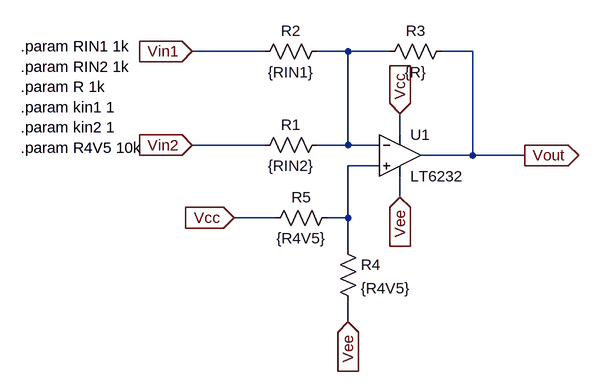
[diagram p0: schematic Addierer.asc]
Addierer.asc, the LTspice schematic file:
Version 4
SHEET 1 1296 680
WIRE -224 -128 -336 -128
WIRE -96 -128 -144 -128
WIRE -32 -128 -96 -128
WIRE 96 -128 48 -128
WIRE -16 0 -16 -32
WIRE -224 16 -336 16
WIRE -96 16 -96 -128
WIRE -96 16 -144 16
WIRE -48 16 -96 16
WIRE 96 32 96 -128
WIRE 96 32 16 32
WIRE 176 32 96 32
WIRE -48 48 -96 48
WIRE -16 96 -16 64
WIRE -208 128 -272 128
WIRE -96 128 -96 48
WIRE -96 128 -128 128
WIRE -96 176 -96 128
WIRE -96 288 -96 256
FLAG -272 128 Vcc
IOPIN -272 128 In
FLAG -16 -32 Vcc
IOPIN -16 -32 In
FLAG -96 288 Vee
IOPIN -96 288 In
FLAG -16 96 Vee
IOPIN -16 96 In
FLAG -336 -128 Vin1
IOPIN -336 -128 In
FLAG -336 16 Vin2
IOPIN -336 16 In
FLAG 176 32 Vout
IOPIN 176 32 Out
SYMBOL Opamps\\LT6232 -16 32 R0
SYMATTR InstName U1
SYMBOL res -128 0 R90
WINDOW 0 0 56 VBottom 2
WINDOW 3 32 56 VTop 2
SYMATTR InstName R1
SYMATTR Value {RIN2}
SYMBOL res -128 -144 R90
WINDOW 0 0 56 VBottom 2
WINDOW 3 32 56 VTop 2
SYMATTR InstName R2
SYMATTR Value {RIN1}
SYMBOL res 64 -144 R90
WINDOW 0 0 56 VBottom 2
WINDOW 3 32 56 VTop 2
SYMATTR InstName R3
SYMATTR Value {R}
SYMBOL res -112 160 R0
SYMATTR InstName R4
SYMATTR Value {R4V5}
SYMBOL res -112 112 R90
WINDOW 0 0 56 VBottom 2
WINDOW 3 32 56 VTop 2
SYMATTR InstName R5
SYMATTR Value {R4V5}
TEXT -600 -136 Left 2 !.param RIN1 1k\n.param RIN2 1k\n.param R 1k\n.param kin1 1\n.param kin2 1\n.param R4V5 10k

The netlist it stands for:
* Addierer.asc
* U1: LT6232 (symbol Opamps\LT6232 not available, pins judged from their places): In+=N002 In-=N001 V+=Vcc V-=Vee OUT=Vout
R1 N001 Vin2 {RIN2}
R2 N001 Vin1 {RIN1}
R3 Vout N001 {R}
R4 N002 Vee {R4V5}
R5 N002 Vcc {R4V5}
.param RIN1 1k
.param RIN2 1k
.param R 1k
.param kin1 1
.param kin2 1
.param R4V5 10k
.backanno
.end